# EAGLE schematic hcgs-cow-baby (EAGLE 9.2.2)
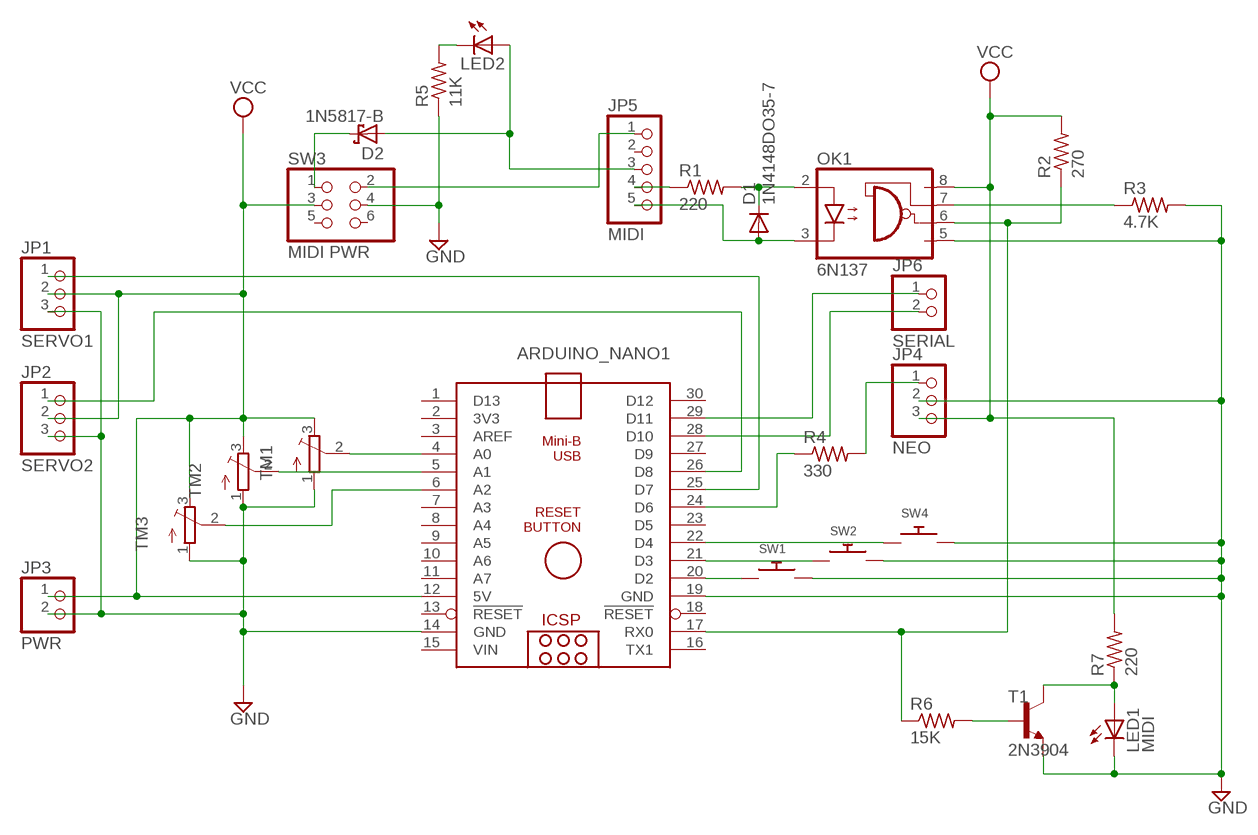
[diagram p0: schematic, sheet 1]

## Parts
ARDUINO_NANO1  ARDUINO_NANO_HCARDUINO_NANO_NO_HOLE  [ARDUINO_NANO_NO_HOLE]
D1  1N4148DO35-7  [DO35-7]
D2  1N5817-B  [DO41-7.6]
JP1  SERVO1  PINHD-1X3  [1X03]
JP2  SERVO2  PINHD-1X3  [1X03]
JP3  PWR  PINHD-1X2  [1X02]
JP4  NEO  PINHD-1X3  [1X03]
JP5  MIDI  PINHD-1X5  [1X05]
JP6  SERIAL  PINHD-1X2  [1X02]
LED1  MIDI  LED5MM  [LED5MM]
LED2  LED5MM  [LED5MM]
OK1  6N137  [DIL08]
R1  220  R-US_0309/12  [0309/12]
R2  270  R-US_0309/12  [0309/12]
R3  4.7K  R-US_0309/12  [0309/12]
R4  330  R-US_0309/12  [0309/12]
R5  11K  R-US_0309/12  [0309/12]
R6  15K  R-US_0309/12  [0309/12]
R7  220  R-US_0309/12  [0309/12]
SW1  SWITCH_PUSHBUTTONEVQ-PE  [TACT_PANA-EVQ]
SW2  SWITCH_PUSHBUTTONEVQ-PE  [TACT_PANA-EVQ]
SW3  MIDI PWR  PINHD-2X3  [2X03]
SW4  SWITCH_PUSHBUTTONEVQ-PE  [TACT_PANA-EVQ]
T1  2N3904  [TO92]
TM1  TRIMPOT3386  [TRIM-3386]
TM2  TRIMPOT3386  [TRIM-3386]
TM3  TRIMPOT3386  [TRIM-3386]

## Nets
GND: ARDUINO_NANO1.14(GND) ARDUINO_NANO1.19(GND) JP1.3 JP2.3 JP3.2 JP4.2 LED1.K(C) OK1.5(GND) R3.2 R5.1 SW1.P$2 SW2.P$2 SW3.4 SW4.P$2 T1.3(E) TM1.1(A) TM2.1(A) TM3.1(A)
N$1: D1.A JP5.5 OK1.3(C)
N$2: D1.C OK1.2(A) R1.2
N$3: OK1.7(VE) R3.1
N$4: ARDUINO_NANO1.17(RX0) OK1.6(VO) R2.1 R6.1
N$5: JP5.4 R1.1
N$6: D2.A JP5.3 LED2.A
N$7: D2.C SW3.1
N$8: ARDUINO_NANO1.20(D2) SW1.P$1
N$10: ARDUINO_NANO1.4(A0) TM1.2(S)
N$11: ARDUINO_NANO1.5(A1) TM2.2(S)
N$12: ARDUINO_NANO1.21(D3) SW2.P$1
N$13: ARDUINO_NANO1.28(D10) JP6.2
N$14: ARDUINO_NANO1.29(D11) JP6.1
N$15: JP4.1 R4.2
N$16: ARDUINO_NANO1.24(D6) R4.1
N$17: LED2.K(C) R5.2
N$18: R6.2 T1.2(B)
N$19: ARDUINO_NANO1.25(D7) JP1.1
N$20: ARDUINO_NANO1.26(D8) JP2.1
N$21: LED1.A R7.1 T1.1(C)
N$22: ARDUINO_NANO1.6(A2) TM3.2(S)
N$23: ARDUINO_NANO1.22(D4) SW4.P$1
N$24: JP5.1 SW3.2
VCC: ARDUINO_NANO1.12(5V) JP1.2 JP2.2 JP3.1 JP4.3 OK1.8(VCC) R2.2 R7.2 SW3.3 TM1.3(E) TM2.3(E) TM3.3(E)
Unconnected: ARDUINO_NANO1.1(D13) ARDUINO_NANO1.2(3V3) ARDUINO_NANO1.3(AREF) ARDUINO_NANO1.7(A3) ARDUINO_NANO1.8(A4) ARDUINO_NANO1.9(A5) ARDUINO_NANO1.10(A6) ARDUINO_NANO1.11(A7) ARDUINO_NANO1.13(!RESET) ARDUINO_NANO1.16(TX1) ARDUINO_NANO1.18(!RESET) ARDUINO_NANO1.23(D5) ARDUINO_NANO1.27(D9) ARDUINO_NANO1.30(D12) JP5.2 SW3.5 SW3.6

## Power pins joined to a net without a drawn wire
VIN: ARDUINO_NANO1.15(VIN)

## Library data of the parts
ARDUINO_NANO1 = ArduinoNano_HC:ARDUINO_NANO_HC: Arduino Nano HC Overview: The Arduino Nano is a small, complete, and breadboard-friendly board based on the ATmega328 (Arduino Nano 3.x) or ATmega168 (Arduino Nano 2.x). It has more or less the same functionality of the Arduino Duemilanove, but in a different package. It lacks only a DC power jack, and works with a Mini-B USB cable instead of a standard one. The Nano was designed and is being produced by Gravitech. Specifications: Microcontroller Atmel ATmega168 or ATmega328 Operating Voltage (logic level) 5 V Input Voltage (recommended) 7-12 V Input Voltage (limits) 6-20 V Digital I/O Pins 14 (of which 6 provide PWM output) Analog Input Pins 8 DC Current per I/O Pin 40 mA Flash Memory 16 KB (ATmega168) or 32 KB (ATmega328) of which 2 KB used by bootloader SRAM 1 KB (ATmega168) or 2 KB (ATmega328) EEPROM 512 bytes (ATmega168) or 1 KB (ATmega328) Clock Speed 16 MHz Dimensions 0.73" x 1.70" Length 45 mm Width 18 mm Weigth 5 g Power: The Arduino Nano can be powered via the Mini-B USB connection, 6-20V unregulated external power supply (pin 30), or 5V regulated external power supply (pin 27). The power source is automatically selected to the highest voltage source. Memory: The ATmega168 has 16 KB of flash memory for storing code (of which 2 KB is used for the bootloader); the ATmega328 has 32 KB, (also with 2 KB used for the bootloader). The ATmega168 has 1 KB of SRAM and 512 bytes of EEPROM (which can be read and written with the EEPROM library); the ATmega328 has 2 KB of SRAM and 1 KB of EEPROM. Input and Output: Each of the 14 digital pins on the Nano can be used as an input or output, using pinMode(), digitalWrite(), and digitalRead() functions. They operate at 5 volts. Each pin can provide or receive a maximum of 40 mA and has an internal pull-up resistor (disconnected by default) of 20-50 kOhms. In addition, some pins have specialized functions. Visit Arduino - ArduinoBoardNano <https://www.arduino.cc/en/Main/ArduinoBoardNano>
D1 = diode:1N4148: DIODE high speed (Philips)
D2 = diode:1N581*: 1.0A SCHOTTKY BARRIER RECTIFIER Source: http://www.diodes.com/datasheets/ds23001.pdf
JP1 JP2 JP4 = pinhead:PINHD-1X3: PIN HEADER
JP3 JP6 = pinhead:PINHD-1X2: PIN HEADER
JP5 = pinhead:PINHD-1X5: PIN HEADER
LED1 LED2 = adafruit:LED: LED OSRAM: - CHIPLED LG R971, LG N971, LY N971, LG Q971, LY Q971, LO R971, LY R971 LH N974, LH R974 LS Q976, LO Q976, LY Q976 LO Q996 - Hyper CHIPLED LW Q18S LB Q993, LB Q99A, LB R99A - SideLED LS A670, LO A670, LY A670, LG A670, LP A670 LB A673, LV A673, LT A673, LW A673 LH A674 LY A675 LS A676, LA A676, LO A676, LY A676, LW A676 LS A679, LY A679, LG A679 - Hyper Micro SIDELED® LS Y876, LA Y876, LO Y876, LY Y876 LT Y87S - SmartLED LW L88C, LW L88S LB L89C, LB L89S, LG L890 LS L89K, LO L89K, LY L89K LS L896, LA L896, LO L896, LY L896 - TOPLED LS T670, LO T670, LY T670, LG T670, LP T670 LSG T670, LSP T670, LSY T670, LOP T670, LYG T670 LG T671, LOG T671, LSG T671 LB T673, LV T673, LT T673, LW T673 LH T674 LS T676, LA T676, LO T676, LY T676, LB T676, LH T676, LSB T676, LW T676 LB T67C, LV T67C, LT T67C, LS T67K, LO T67K, LY T67K, LW E67C LS E67B, LA E67B, LO E67B, LY E67B, LB E67C, LV E67C, LT E67C LW T67C LS T679, LY T679, LG T679 LS T770, LO T770, LY T770, LG T770, LP T770 LB T773, LV T773, LT T773, LW T773 LH T774 LS E675, LA E675, LY E675, LS T675 LS T776, LA T776, LO T776, LY T776, LB T776 LHGB T686 LT T68C, LB T68C - Hyper Mini TOPLED® LB M676 - Mini TOPLED Santana® LG M470 LS M47K, LO M47K, LY M47K Source: http://www.osram.convergy.de/
OK1 = optocoupler:6N137: MOTOROLA OPTO COUPLER; MPN: 6N137; OC_FARNELL: 1328376; OC_NEWARK: 52M1895
R1-R7 = adafruit:R-US_: RESISTOR, American symbol
SW1 SW2 SW4 = adafruit:SWITCH_PUSHBUTTON: Buttons SOFTTOUCHSMD_SJ - Soft touch temporary push button (Super Junk Akihabara) Compatible with SKPMANE010 [Mouser: 688-SKPMAN] C&K_KSS = Digikey: KSS221GLFS
SW3 = pinhead:PINHD-2X3: PIN HEADER
T1 = transistor:2N3904: NPN TRANSISTOR
TM1-TM3 = adafruit:TRIMPOT: SMT trimmer potentiometer part number TC33X http://www.ladyada.net/library/eagle